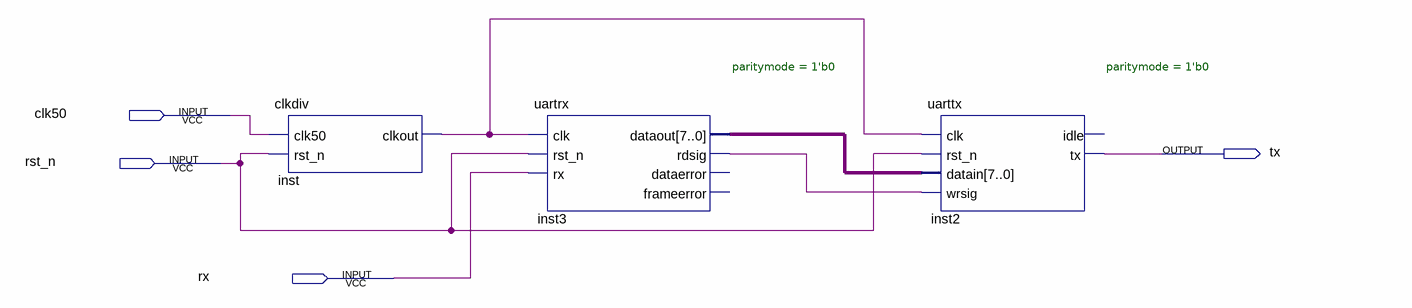
[diagram p0: schematic sheet]
// Quartus schematic uart_rx.bdf as structural Verilog: 3 symbols, 4 pins
module uart_rx (
  input  clk50,
  input  rst_n,
  input  rx,
  output tx
);

  wire inst3_rdsig, inst_clkout;
  wire [7:0] inst3_dataout;

  clkdiv inst (.clk50(clk50), .rst_n(rst_n), .clkout(inst_clkout));
  uartrx #(.paritymode(1'b0)) inst3 (
    .clk(inst_clkout), .rst_n(rst_n), .rx(rx), .dataout(inst3_dataout), .rdsig(inst3_rdsig));  // open: dataerror, frameerror
  uarttx #(.paritymode(1'b0)) inst2 (
    .clk(inst_clkout), .rst_n(rst_n), .datain(inst3_dataout), .wrsig(inst3_rdsig), .tx(tx));  // open: idle
endmodule
